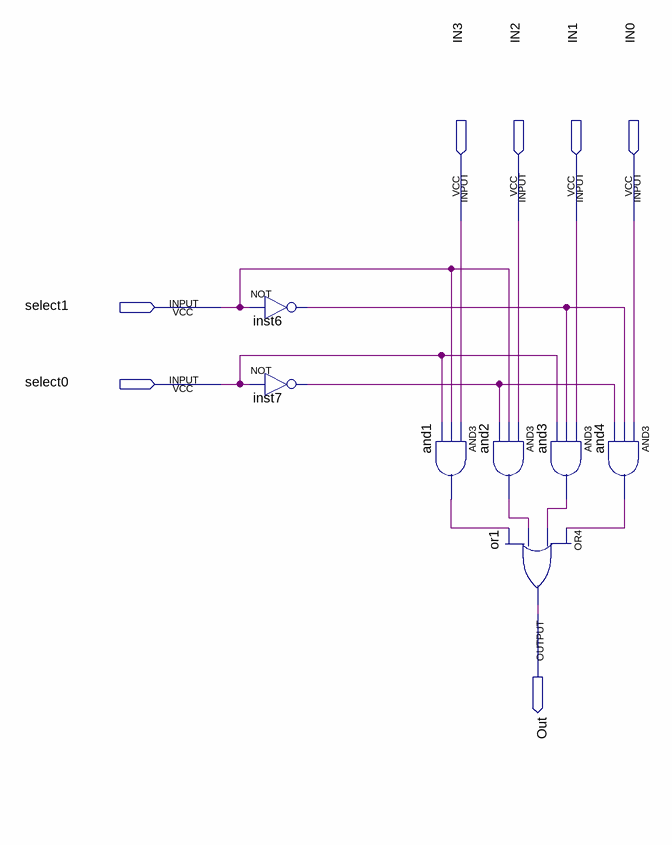
[diagram p0: schematic sheet]
// Quartus schematic MUX41.bdf as structural Verilog: 7 symbols, 7 pins
module MUX41 (
  input  IN3,
  input  IN2,
  input  IN1,
  input  IN0,
  input  select1,
  input  select0,
  output Out
);

  wire and1_out, and2_out, and3_out, and4_out, inst6_out, inst7_out;

  not inst6 (inst6_out, select1);
  not inst7 (inst7_out, select0);
  and and1 (and1_out, IN3, select1, select0);
  and and2 (and2_out, IN2, select1, inst7_out);
  or or1 (Out, and4_out, and3_out, and2_out, and1_out);
  and and3 (and3_out, IN1, inst6_out, select0);
  and and4 (and4_out, IN0, inst6_out, inst7_out);
endmodule
